# Altium schematic sheet HDMI.SchDoc
size A3; DocumentNumber: 6; SheetNumber: 6; SheetTotal: 10; PageSetup: Record=PageOptions|CenterHorizontal=True|CenterVertical=True|PrintScale=0.97|XCorrection=1.00|YCorrection=1.00|PrintKind=1|BorderSize=5000000|LeftOffset=0|BottomOffset=0|Orientation=2|PaperLength=2970|PaperWidth=2100|Scale=100|PaperSource=7|PrintQuality=600|MediaType=1|DitherType=10|PaperKind=A4|PrintScaleMode=1
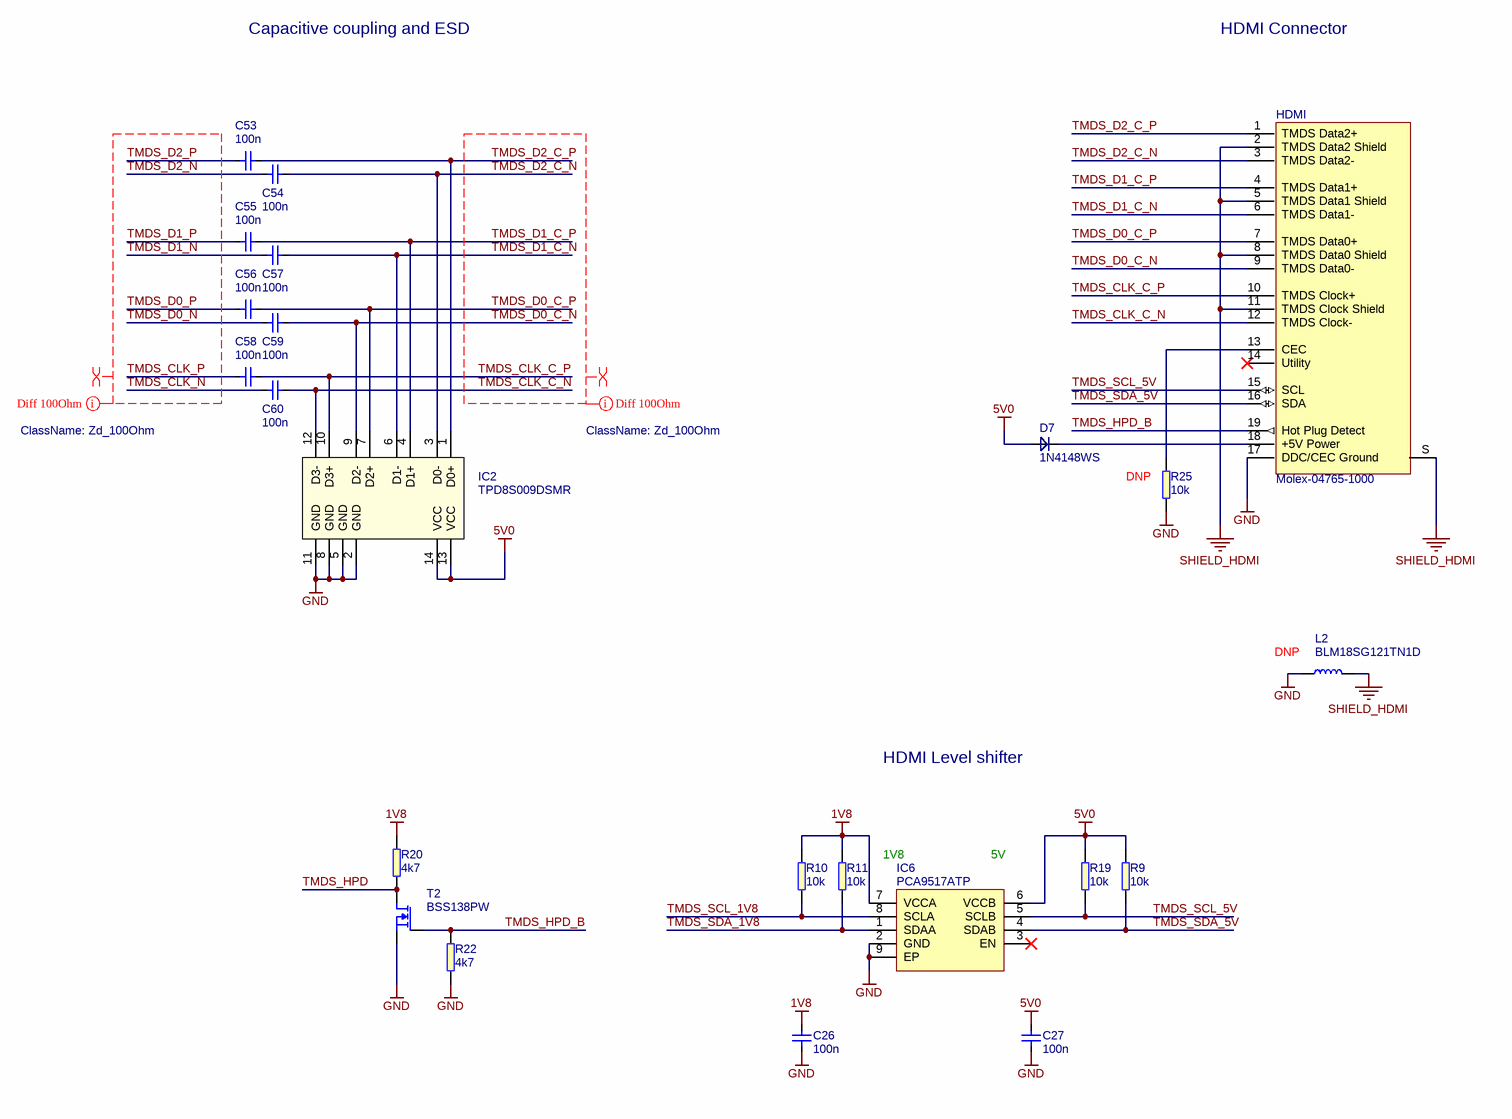
[diagram p0: HDMI.SchDoc]

## Parts
C26  100n  [0603]
C27  100n  [0603]
C53  100n  [0402]
C54  100n  [0402]
C55  100n  [0402]
C56  100n  [0402]
C57  100n  [0402]
C58  100n  [0402]
C59  100n  [0402]
C60  100n  [0402]
D7  1N4148WS  [SOD-323]
HDMI  Molex-04765-1000  [CON-Molex-04765-1000]
IC2  Part Symbol: TPD8S009DSMR  [SON-15]  (hidden comment: TPD8S009)
IC6  PCA9517ATP  [PCA9517ATP]
L2  BLM18SG121TN1D  [0603]
R9  10k  [0603]
R10  10k  [0603]
R11  10k  [0603]
R19  10k  [0603]
R20  4k7  [0603]
R22  4k7  [0603]
R25  10k  [0402]
T2  BSS138PW  [SC70-3]

## Nets
1V8: C26.2 IC6.7(VCCA) R10.2 R11.2 R20.2
5V0: C27.2 D7.A IC2.13(VCC) IC2.14(VCC) IC6.6(VCCB) R9.2 R19.2
GND: C26.1 C27.1 HDMI.17(DDC/CEC_Ground) IC2.2(GND) IC2.5(GND) IC2.8(GND) IC2.11(GND) IC6.2(GND) IC6.9(EP) L2.1 R22.1 R25.1 T2.2(S)
SHIELD_HDMI: HDMI.2(TMDS_Data2_Shield) HDMI.5(TMDS_Data1_Shield) HDMI.8(TMDS_Data0_Shield) HDMI.11(TMDS_Clock_Shield) HDMI.S(SH) L2.2
TMDS_CLK_C_N: C60.2 HDMI.12(TMDS_Clock-) IC2.12(D3-)
TMDS_CLK_C_P: C58.2 HDMI.10(TMDS_Clock+) IC2.10(D3+)
TMDS_CLK_N: C60.1
TMDS_CLK_P: C58.1
TMDS_D0_C_N: C59.2 HDMI.9(TMDS_Data0-) IC2.9(D2-)
TMDS_D0_C_P: C56.2 HDMI.7(TMDS_Data0+) IC2.7(D2+)
TMDS_D0_N: C59.1
TMDS_D0_P: C56.1
TMDS_D1_C_N: C57.2 HDMI.6(TMDS_Data1-) IC2.6(D1-)
TMDS_D1_C_P: C55.2 HDMI.4(TMDS_Data1+) IC2.4(D1+)
TMDS_D1_N: C57.1
TMDS_D1_P: C55.1
TMDS_D2_C_N: C54.2 HDMI.3(TMDS_Data2-) IC2.3(D0-)
TMDS_D2_C_P: C53.2 HDMI.1(TMDS_Data2+) IC2.1(D0+)
TMDS_D2_N: C54.1
TMDS_D2_P: C53.1
TMDS_HPD: R20.1 T2.3(D)
TMDS_HPD_B: HDMI.19(Hot_Plug_Detect) R22.2 T2.1(G)
TMDS_SCL_1V8: IC6.8(SCLA) R10.1
TMDS_SCL_5V: HDMI.15(SCL) IC6.5(SCLB) R19.1
TMDS_SDA_1V8: IC6.1(SDAA) R11.1
TMDS_SDA_5V: HDMI.16(SDA) IC6.4(SDAB) R9.1
NetD7_C: D7.C HDMI.18(+5V_Power)
NetHDMI_13: HDMI.13(CEC) R25.2

Not connected (* = marked no-connect by the designer): HDMI 14(Utility)*; IC6 3(EN)*

## Layout directives
net class Zd_100Ohm: TMDS_CLK_C_N, TMDS_CLK_C_P, TMDS_CLK_N, TMDS_CLK_P, TMDS_D0_C_N, TMDS_D0_C_P, TMDS_D0_N, TMDS_D0_P, TMDS_D1_C_N, TMDS_D1_C_P, TMDS_D1_N, TMDS_D1_P, TMDS_D2_C_N, TMDS_D2_C_P, TMDS_D2_N, TMDS_D2_P
differential pair: TMDS_CLK_C_N, TMDS_CLK_C_P, TMDS_CLK_N, TMDS_CLK_P, TMDS_D0_C_N, TMDS_D0_C_P, TMDS_D0_N, TMDS_D0_P, TMDS_D1_C_N, TMDS_D1_C_P, TMDS_D1_N, TMDS_D1_P, TMDS_D2_C_N, TMDS_D2_C_P, TMDS_D2_N, TMDS_D2_P

## Notes on the sheet
- Capacitive coupling and ESD
- HDMI Connector
- (near R25) DNP
- (near L2) DNP
- HDMI Level shifter
- 1V8
- (near IC6) 5V
- Title:
- Size:
- Date:
- A3
- Revision:
- Page:
- of
- Antmicro Ltd.
- File:
- www.antmicro.com

## Library data of the parts
C26 C27 = C_100n_0603: MLCC SMT Capacitor 100nF 0603; Manufacturer: WALSIN; Part Symbol: 0603B104K500CT; Part Number: C_100n_0603; Value: 100n
C53-C60 = C_100n_0402: MLCC SMT Capacitor 100nF 0402; Manufacturer: MULTICOMP; Part Symbol: MC0402X104M100CT; Part Number: C_100n_0402; Value: 100n
D7 = 1N4148WS: Diode small signal; Manufacturer: MULTICOMP; Part Number: 1N4148WS; Value: 1N4148WS; Part Symbol: 1N4148WS
HDMI = CON-Molex-47659-1000: HDMI connector vertical; Manufacturer: Molex; Part Number: CON-Molex-47659-1000; Value: Molex-04765-1000; Part Symbol: 47659-1000
IC2 = TPD8S009: 8-Channel ESD Protection for DisplayPort and HDMI; Manufacturer: TEXAS INSTRUMENTS; Part Number: TPD8S009; Value: TPD8S009
IC6 = PCA9517ATP: I2C BUS REPEATER W/ LEVEL TRANS, HWSON-8; Manufacturer: NXP; Part Number: PCA9517ATP; Value: PCA9517ATP; Part Symbol: PCA9517ATP
L2 = BLM18SG121TN1D: FERRITE BEAD, 0.025OHM, 3A, 0603; Manufacturer: MURATA; Part Number: BLM18SG121TN1D; Value: BLM18SG121TN1D; Part Symbol: BLM18SG121TN1D
R9-R11 R19 = R_10k_0603: SMT Resistor 10k 0603; Manufacturer: BOURNS; Part Symbol: CR0603-JW-103ELF; Part Number: R_10k_0603; Value: 10k
R20 R22 = R_4k7_0603: SMT Resistor 4k7 0603; Manufacturer: BOURNS; Part Symbol: CR0603-FX-4701ELF; Part Number: R_4k7_0603; Value: 4k7
R25 = R_10k_0402: SMT Resistor 0402; Manufacturer: MULTICOMP; Part Symbol: MCMR04X1002FTL; Part Number: R_10k_0402; Value: 10k
T2 = BSS138PW: MOSFET, N CH, 60V, 0.2A; Manufacturer: NXP; Value: BSS138PW; Part Number: BSS138PW; Part Symbol: BSS138PW